# Altium project ST-Link V3 PCB.PrjPcb
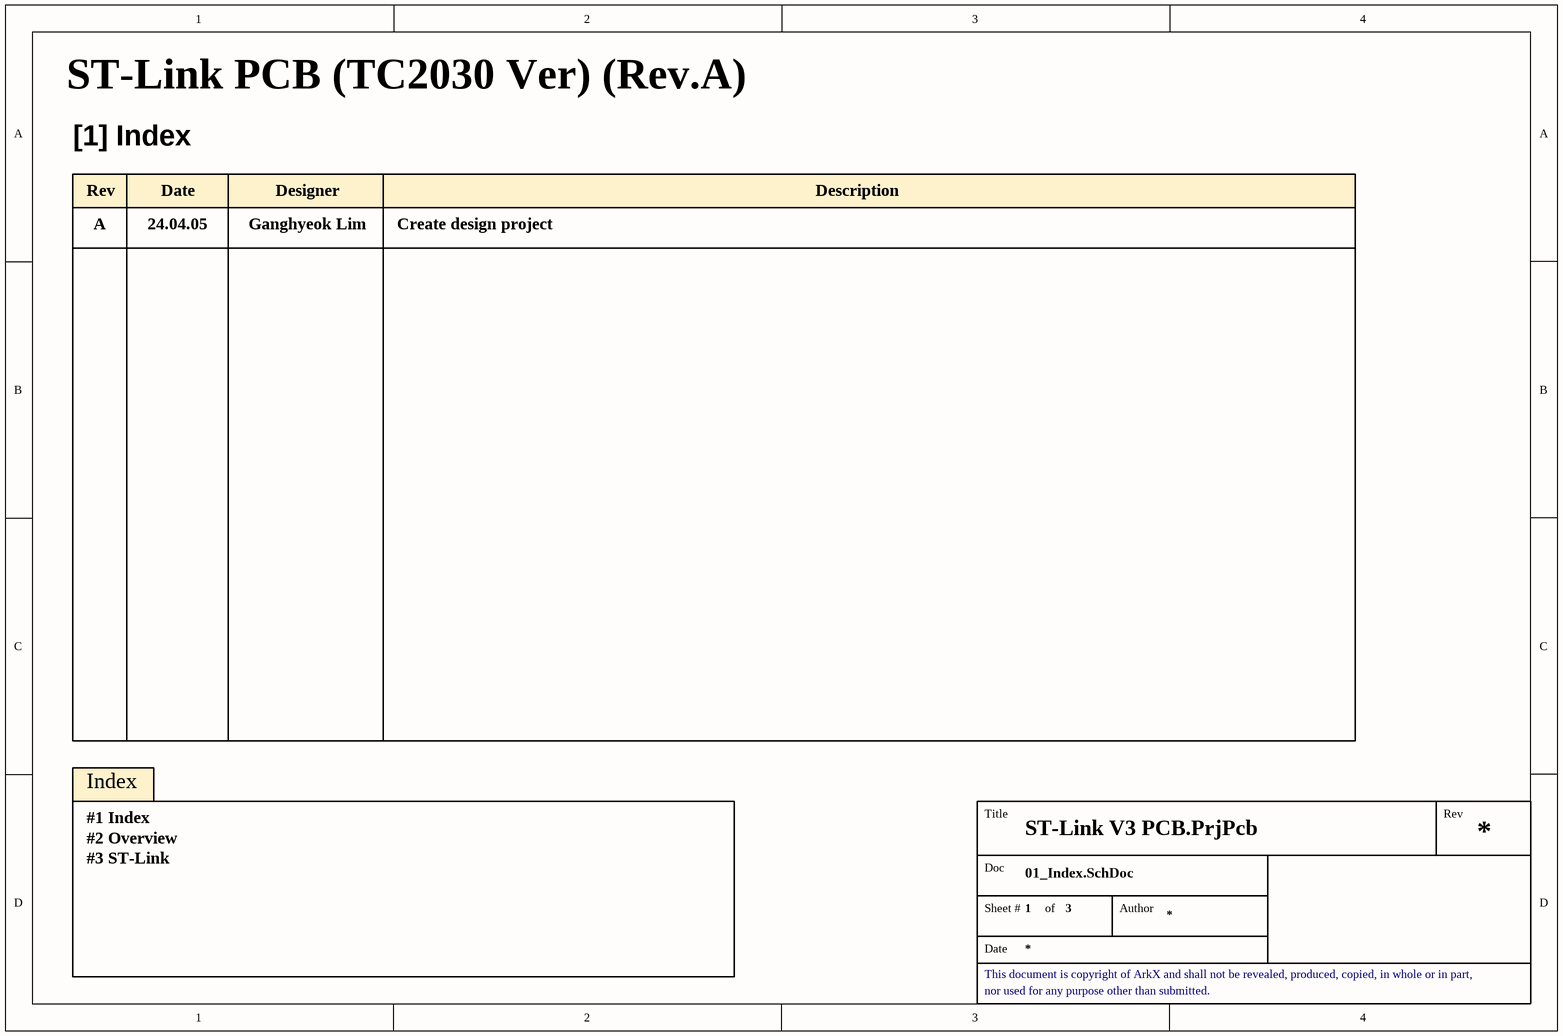
[diagram p0: 01_Index.SchDoc]
3 sheets, 3 parts. Net scope: global (net labels, ports and power ports of the same name join across sheets).
Board file: ST-Link_V3_PCB.PcbDoc
Sheets:
  01_Index.SchDoc
  02_Overview.SchDoc
  03_ST-Link.SchDoc

## Sheet 01_Index.SchDoc
size A4; SheetNumber: 1; SheetTotal: 3

### Notes on the sheet
- ST-Link PCB (TC2030 Ver) (Rev.A)
- [1] Index
- Rev
- A
- 24.04.05
- Date
- Ganghyeok Lim
- Designer
- Create design project
- Description
- Index
- #1 Index
- #2 Overview
- #3 ST-Link
- Title
- Doc
- Sheet #
- of
- Author
- This document is copyright of ArkX and shall not be revealed, produced, copied, in whole or in part,
- nor used for any purpose other than submitted.

## Sheet 02_Overview.SchDoc
size A4; SheetNumber: 2; SheetTotal: 3

### Notes on the sheet
- Title
- Rev
- Doc
- Sheet #
- of
- Author
- This document is copyright of ArkX and shall not be revealed, produced, copied, in whole or in part,
- Date
- nor used for any purpose other than submitted.

## Sheet 03_ST-Link.SchDoc
size A4; SheetNumber: 3; SheetTotal: 3
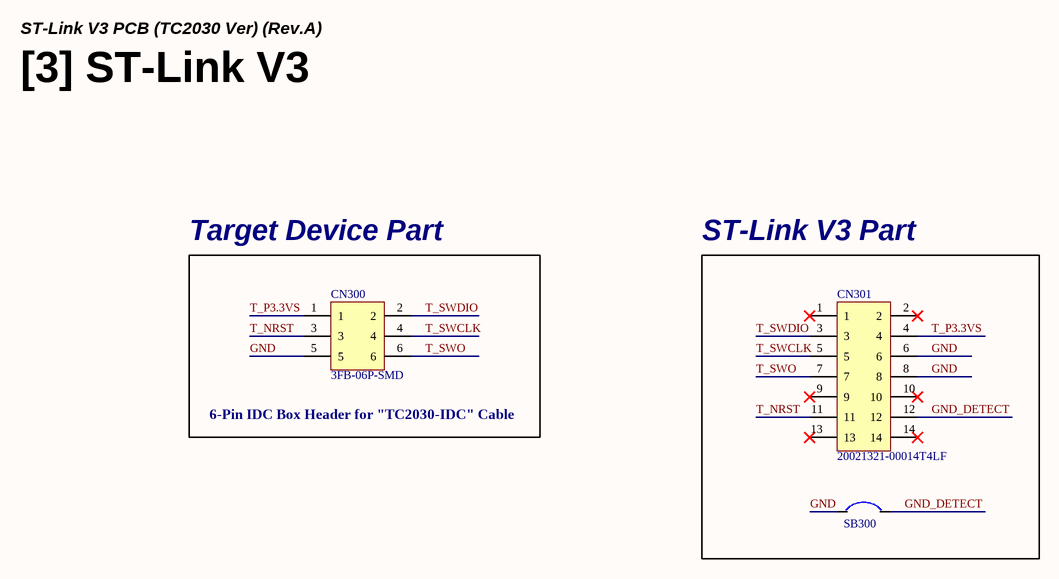
[diagram p1: 03_ST-Link.SchDoc]

### Parts
CN300  3FB-06P-SMD  [CON_BOX_HEADER_DUAL_2x3PIN(2.54MM)]
CN301  20021321-00014T4LF  [CON_RCPT_DUAL_2x7PIN(1.27MM)]
SB300  SB  [SB (Solder-Bridge)]  (value not drawn)

### Blocks framed on the sheet
Target Device Part: CN300
ST-Link V3 Part: CN301 SB300

### Nets
GND: CN300.5 CN301.6 CN301.8 SB300.1
GND_DETECT: CN301.12 SB300.2
T_NRST: CN300.3 CN301.11
T_P3.3VS: CN300.1 CN301.4
T_SWCLK: CN300.4 CN301.5
T_SWDIO: CN300.2 CN301.3
T_SWO: CN300.6 CN301.7

Not connected (* = marked no-connect by the designer): CN301 1* 2* 9* 10* 13* 14*

### Notes on the sheet
- ST-Link V3 PCB (TC2030 Ver) (Rev.A)
- [3] ST-Link V3
- (near CN300) 6-Pin IDC Box Header for "TC2030-IDC" Cable
- Title
- Rev
- Doc
- Sheet #
- of
- Author
- This document is copyright of ArkX and shall not be revealed, produced, copied, in whole or in part,
- Date
- nor used for any purpose other than submitted.

### Library data of the parts
CN300 = CON_BOX_HEADER_DUAL_2x3PIN(2.54MM): BOX HEADER SMD / 2.54mm pitch / with IDC Connector
CN301 = CON_RCPT_DUAL_2x7PIN(1.27MM): 14 Position Receptacle Connector 0.050" (1.27mm) Surface Mount Gold; LCSC Part #: C5412490; JLCPCB Part Type: Extended Part
SB300 = SB_Solder-Bridge